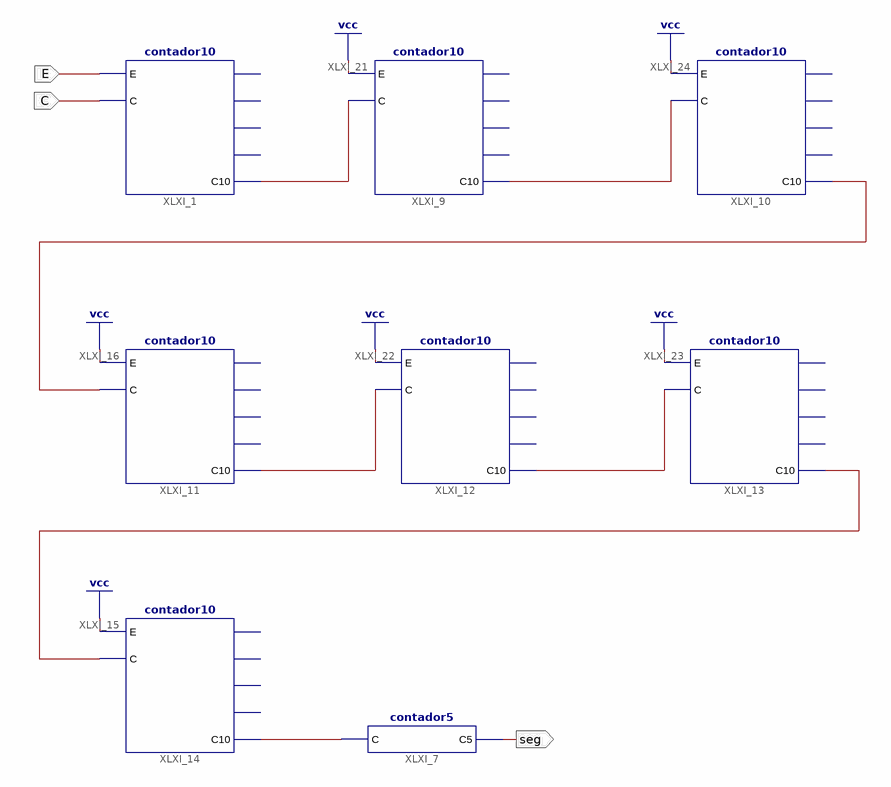
[diagram p0: schematic sheet 1]
// Xilinx ISE schematic segundo.sch (spartan3e) as structural Verilog: 8 symbols, 3 ports
module segundo (
  input  E,
  input  C,
  output seg
);

  wire XLXN_15, XLXN_16, XLXN_19, XLXN_20, XLXN_21, XLXN_24, XLXN_31;

  contador10 XLXI_1 (.C(C), .C10(XLXN_31), .E(E));  // open: Q0, Q1, Q2, Q3
  contador5 XLXI_7 (.C(XLXN_21), .C5(seg));
  contador10 XLXI_9 (.C(XLXN_31), .C10(XLXN_15), .E(1'b1));  // open: Q0, Q1, Q2, Q3
  contador10 XLXI_10 (.C(XLXN_15), .C10(XLXN_16), .E(1'b1));  // open: Q0, Q1, Q2, Q3
  contador10 XLXI_11 (.C(XLXN_16), .C10(XLXN_24), .E(1'b1));  // open: Q0, Q1, Q2, Q3
  contador10 XLXI_12 (.C(XLXN_24), .C10(XLXN_19), .E(1'b1));  // open: Q0, Q1, Q2, Q3
  contador10 XLXI_14 (.C(XLXN_20), .C10(XLXN_21), .E(1'b1));  // open: Q0, Q1, Q2, Q3
  contador10 XLXI_13 (.C(XLXN_19), .C10(XLXN_20), .E(1'b1));  // open: Q0, Q1, Q2, Q3
endmodule
